# EAGLE design stabilizator_5V (EAGLE 4.16)
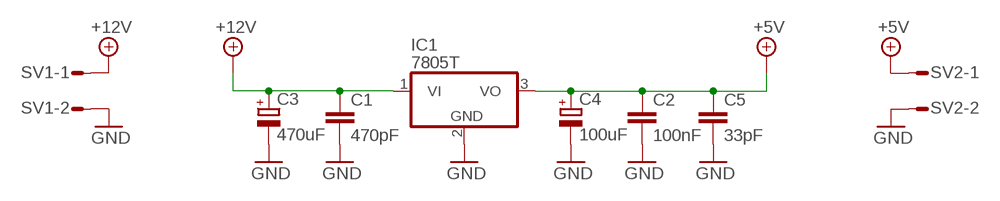
[diagram p0: schematic, sheet 1]

## Parts
C1  470pF  C-EU075-032X103  [C075-032X103]
C2  100nF  C-EU075-032X103  [C075-032X103]
C3  470uF  CPOL-EUE3.5-10  [E3,5-10]
C4  100uF  CPOL-EUE2.5-7  [E2,5-7]
C5  33pF  C-EU075-032X103  [C075-032X103]
IC1  7805T  [TO220H]
SV1  S02P  [S02P]
SV2  S02P  [S02P]

## Nets
+5V: C2.1 C4.+ C5.1 IC1.3(VO) SV2.1
+12V: C1.1 C3.+ IC1.1(VI) SV1.1
GND: C1.2 C2.2 C3.- C4.- C5.2 IC1.2(GND) SV1.2 SV2.2

## Library data of the parts
C1 C2 C5 = rcl:C-EU: CAPACITOR, European symbol
C3 C4 = rcl:CPOL-EU: POLARIZED CAPACITOR, European symbol
IC1 = linear:78*: Positive VOLTAGE REGULATOR Source: http://cache.national.com/ds/LM/LM78L05.pdf http://www.fairchildsemi.com/ds/LM/LM7805.pdf
SV1 SV2 = con-amp-mt:S02P: AMP MT CONNECTOR

## Net classes
1 bart: width 0.025 mm, drill 0.025 mm, clearance 0.051 mm

## Board
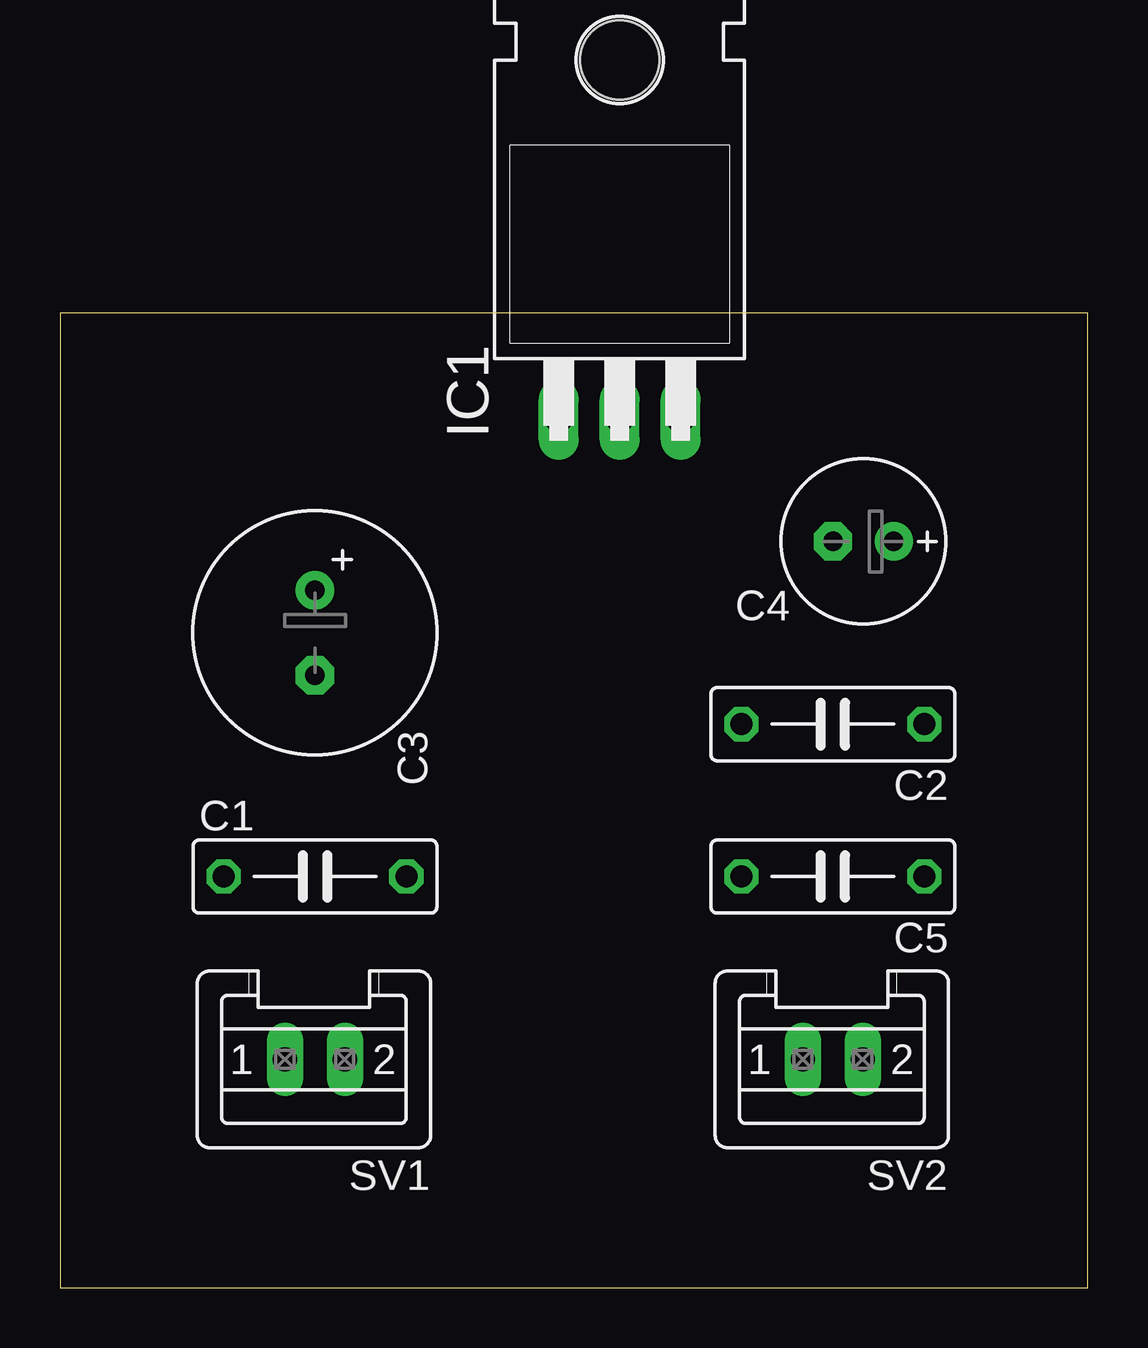
[diagram p1: board, top side]
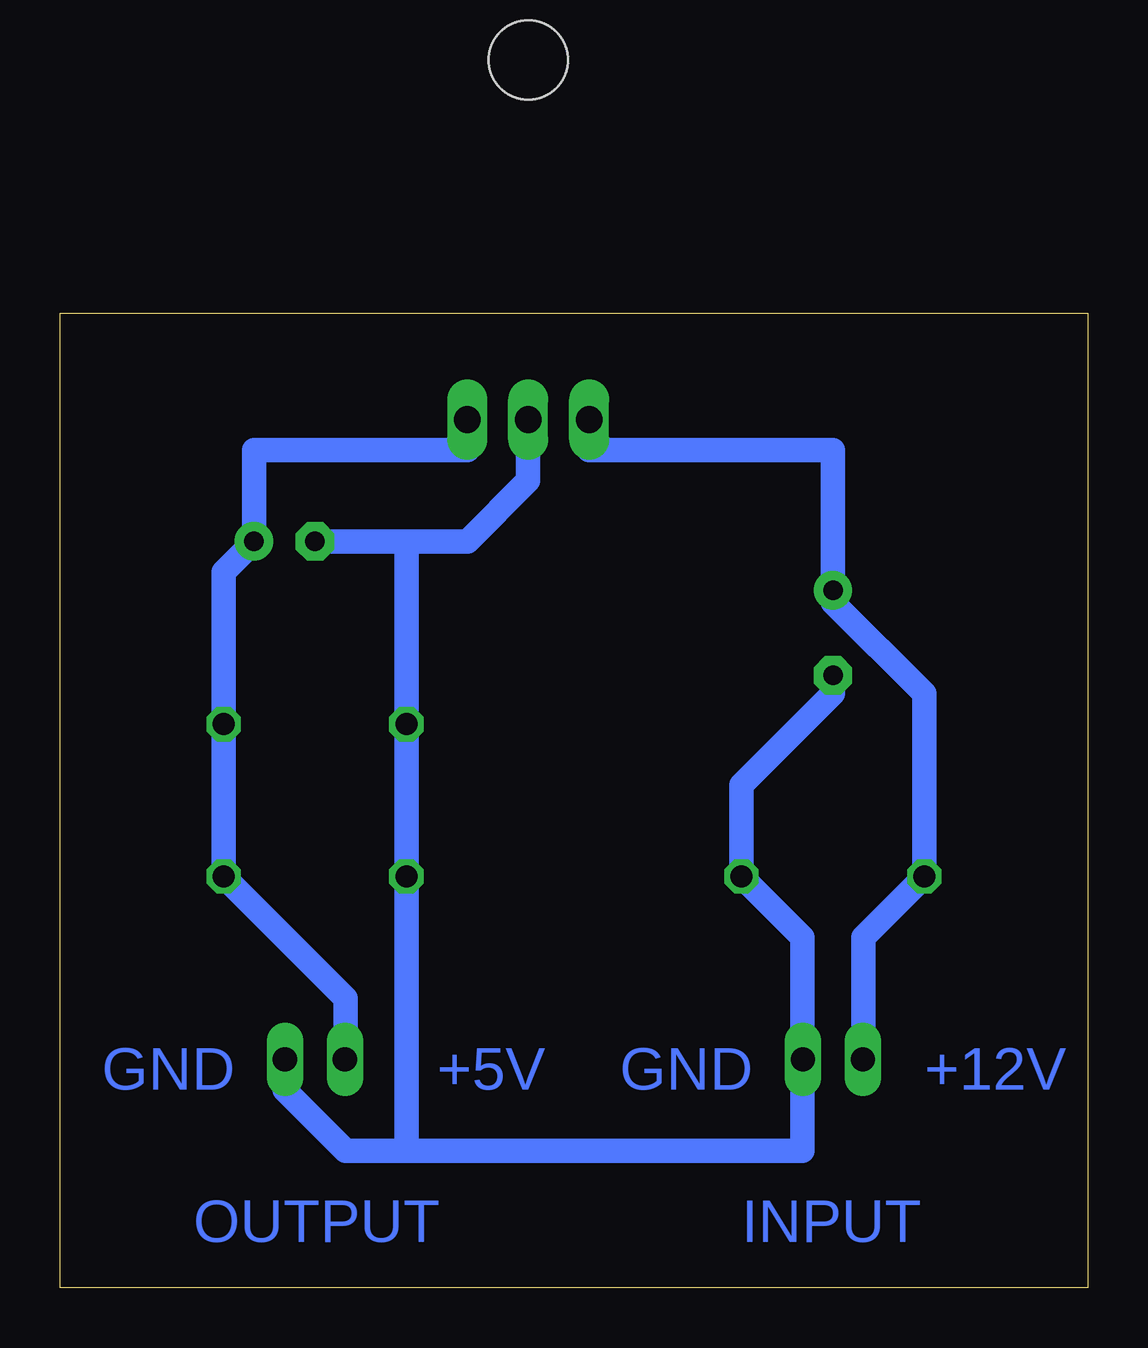
[diagram p2: board, bottom side, seen from below]

Size 42.85 x 40.63 mm. Coordinates in mm from the lower left corner, seen from the top.
Outline: 0,0 42.85,0 42.85,40.63 0,40.63 0,0
Copper layers (1*16): Top 0.035mm / dielectric 1.5mm / Bottom 0.035mm
Design rules "default": minimum track width 10mil, minimum drill 24mil, track to track 8mil, track to pad 8mil, pad to pad 8mil, via to via 8mil, smd to smd 8mil, copper to edge 40mil, drill to drill 8mil, minimum pad ring 10mil, minimum via ring 8mil, stop-mask expansion 4mil, vias tented up to drill 0mil, thermal gap 10mil

### Footprints (pad centres in the part's own frame; a part is rotated, then mirrored left to right if it is on the bottom)
C075-032X103 = drill 0.914 octagon: 1 -3.81,0; 2 3.81,0
E3,5-10 = drill 0.813 pad 1.6 round: + -1.778,0 | drill 0.813 pad 1.6 octagon: - 1.778,0
E2,5-7 = drill 0.813 pad 1.6 round: + -1.27,0 | drill 0.813 pad 1.6 octagon: - 1.27,0
TO220H = drill 1.118 long: 1 -2.54,-10.16; 2 0,-10.16; 3 2.54,-10.16 | hole 3.302: 0,4.826
S02P = drill 1.016 long: 1 1.25,0; 2 -1.25,0

### Placement (x,y rotation side)
C1  10.63,17.14 0 top
C2  32.22,23.49 180 top
C3  10.63,27.3 270 top
C4  33.49,31.11 180 top
C5  32.22,17.14 180 top
IC1  23.33,46.35 0 top
SV1  10.63,9.52 180 top
SV2  32.22,9.52 180 top

### Tracks (layer width: path | path; a pad name or v marks a point on that pad's centre or on a via)
+5V
  Bottom 1.016: SV2.1 30.95,12.06 C5.1 C2.1 36.03,29.84 C4.+ 34.76,34.92 25.87,34.92 IC1.3
+12V
  Bottom 0.254: 10.63,28.57 C3.+
  Bottom 1.016: SV1.1 9.36,10.79 9.36,14.6 C1.1 6.82,24.76 10.63,28.57 | IC1.1 20.79,34.92 10.63,34.92 C3.+
GND
  Bottom 1.016: 28.41,31.11 C4.- | 28.41,31.11 C2.2 C5.2 28.41,5.71 | 28.41,31.11 25.87,31.11 23.33,33.65 IC1.2 | 28.41,5.71 11.9,5.71 11.9,8.25 SV1.2 11.9,10.79 11.9,14.6 C1.2 14.44,20.95 10.63,24.76 C3.- | 28.41,5.71 30.95,5.71 33.49,8.25 SV2.2

### Text on the board
Bottom: +12V | GND | +5V | GND | INPUT | OUTPUT